# Altium project yaoyaobang.PrjPcb
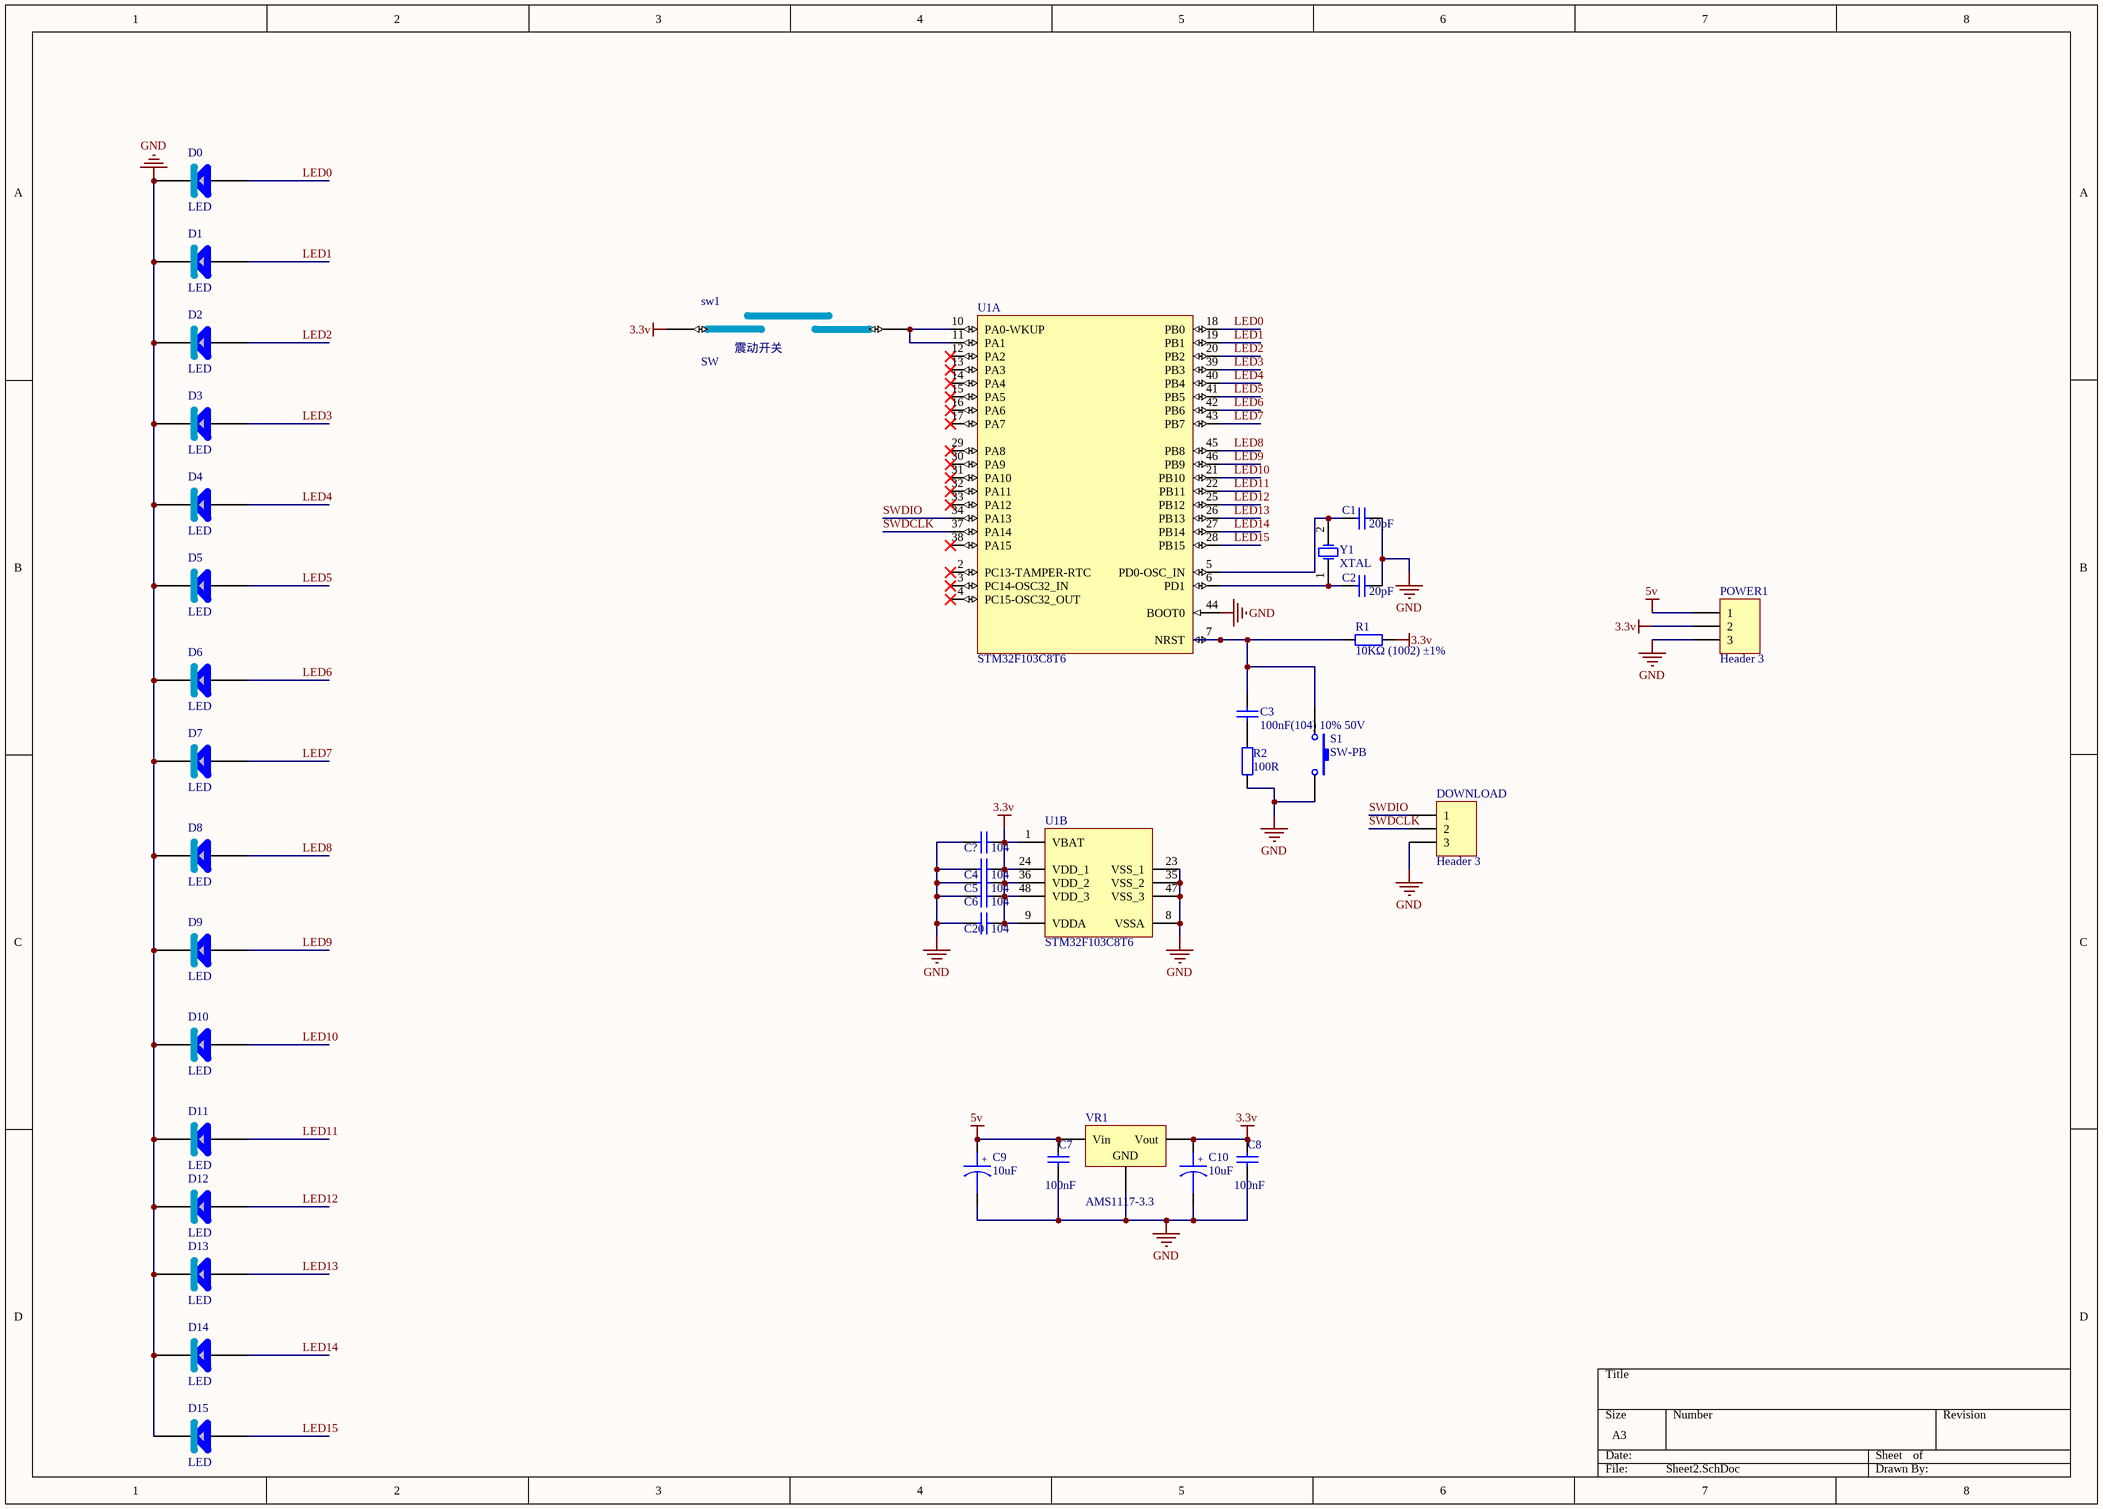
[diagram p0: Sheet2.SchDoc]
1 sheet, 37 parts. Net scope: global (net labels, ports and power ports of the same name join across sheets).
Board file: PCB1.PcbDoc

## Sheet Sheet2.SchDoc
size A3

### Parts
C1  20pF  [0805_C]
C2  20pF  [0805_C]
C3  100nF(104) 10% 50V  [0805_C]
C4  104  [0805_C]
C5  104  [0805_C]
C6  104  [0805_C]
C7  100nF  [0805_C]
C8  100nF  [0805_C]
C9  10uF  [0805_C]
C10  10uF  [0805_C]
C20  104  [0805_C]
C?  104  [0805_C]
D0  LED  [PCBComponent_1]
D1  LED  [PCBComponent_1]
D2  LED  [PCBComponent_1]
D3  LED  [PCBComponent_1]
D4  LED  [PCBComponent_1]
D5  LED  [PCBComponent_1]
D6  LED  [PCBComponent_1]
D7  LED  [PCBComponent_1]
D8  LED  [PCBComponent_1]
D9  LED  [PCBComponent_1]
D10  LED  [PCBComponent_1]
D11  LED  [PCBComponent_1]
D12  LED  [PCBComponent_1]
D13  LED  [PCBComponent_1]
D14  LED  [PCBComponent_1]
D15  LED  [PCBComponent_1]
DOWNLOAD  Header 3  [HDR1X3]
POWER1  Header 3  [HDR1X3]
R1  10KΩ (1002) ±1%  [0805_R]
R2  100R  [0805_R]
S1  SW-PB  [KEY_3*6]
sw1  SW  [PCBComponent_1 - duplicate]
U1  STM32F103C8T6  [LQFP-48_7x7x05P]  (parts A,B of 2)
VR1  AMS1117-3.3  [SOT-223]
Y1  XTAL  [BCY-W2/D3.1]

### Nets
3.3v: C4.2 C5.2 C6.2 C8.2 C10.1 C20.2 C?.2 POWER1.2 R1.1 sw1.3 U1.1(VBAT) U1.9(VDDA) U1.24(VDD_1) U1.36(VDD_2) U1.48(VDD_3) VR1.2(Vout)
5v: C7.2 C9.1 POWER1.1 VR1.3(Vin)
GND: C1.2 C2.2 C4.1 C5.1 C6.1 C7.1 C8.1 C9.2 C10.2 C20.1 C?.1 D0.1 D1.1 D2.1 D3.1 D4.1 D5.1 D6.1 D7.1 D8.1 D9.1 D10.1 D11.1 D12.1 D13.1 D14.1 D15.1 DOWNLOAD.3 POWER1.3 R2.1 S1.2 U1.8(VSSA) U1.23(VSS_1) U1.35(VSS_2) U1.44(BOOT0) U1.47(VSS_3) VR1.1(GND)
LED0: D0.0 U1.18(PB0)
LED1: D1.0 U1.19(PB1)
LED2: D2.0 U1.20(PB2)
LED3: D3.0 U1.39(PB3)
LED4: D4.0 U1.40(PB4)
LED5: D5.0 U1.41(PB5)
LED6: D6.0 U1.42(PB6)
LED7: D7.0 U1.43(PB7)
LED8: D8.0 U1.45(PB8)
LED9: D9.0 U1.46(PB9)
LED10: D10.0 U1.21(PB10)
LED11: D11.0 U1.22(PB11)
LED12: D12.0 U1.25(PB12)
LED13: D13.0 U1.26(PB13)
LED14: D14.0 U1.27(PB14)
LED15: D15.0 U1.28(PB15)
SWDCLK: DOWNLOAD.2 U1.37(PA14)
SWDIO: DOWNLOAD.1 U1.34(PA13)
NetC1_1: C1.1 U1.5(PD0-OSC_IN) Y1.2(OSC2)
NetC2_1: C2.1 U1.6(PD1) Y1.1(OSC1)
NetC3_1: C3.1 R1.2 S1.1 U1.7(NRST)
NetC3_2: C3.2 R2.2
Netsw1_2: sw1.2 U1.10(PA0-WKUP) U1.11(PA1)

Not connected (* = marked no-connect by the designer): U1 2(PC13-TAMPER-RTC)* 3(PC14-OSC32_IN)* 4(PC15-OSC32_OUT)* 12(PA2)* 13(PA3)* 14(PA4)* 15(PA5)* 16(PA6)* 17(PA7)* 29(PA8)* 30(PA9)* 31(PA10)* 32(PA11)* 33(PA12)* 38(PA15)*

### Notes on the sheet
- (in symbol SW) 震动开关
- (in symbol 电解电容) +

### Library data of the parts
C1 C2 = 0805 20pF (200) 5% 50V: 贴片电容; ComponentLink1Description: 供应商链接; ComponentLink1URL: http://www.szlcsc.com/product/details_2150.html; Package: 0805; Supplier: LC; SuppliersPartNumber: C1798
C3-C8 C20 C? = 0805 100nF(104) 10% 50V: 贴片电容; ComponentLink1Description: 供应商链接; ComponentLink1URL: http://www.szlcsc.com/product/details_50686.html; Package: 0805; Supplier: LC; SuppliersPartNumber: C49678
C9 C10 = 电解电容: Capacitor
DOWNLOAD POWER1 = Header 3: Header, 3-Pin; LatestRevisionDate: 17-Jul-2002; LatestRevisionNote: Re-released for DXP Platform.; Publisher: Altium Limited
R1 R2 = 0805 10KΩ (1002) 1%: 贴片电阻; ComponentLink1Description: 供应商链接; ComponentLink1URL: http://www.szlcsc.com/product/details_18102.html; Package: 0805; Supplier: LC; SuppliersPartNumber: C17414
S1 = SW-PB: Switch; pin to pad: 2>0; Published: 24-Mar-1999; LatestRevisionDate: 17-Jul-2002; LatestRevisionNote: Re-released for DXP Platform.; PackageReference: SPST-2; Publisher: Altium Limited; PackageDescription: Switch; 2 Leads
U1 = STM32F103C8T6: ARM; ComponentLink1Description: 供应商链接; ComponentLink1URL: http://www.szlcsc.com/product/details_9243.html; Package: LQFP-48_7x7x05P; Supplier: LC; SuppliersPartNumber: C8734
VR1 = SOT-223 AMS1117-3.3: 低压差线性稳压(LDO); ComponentLink1Description: 供应商链接; ComponentLink1URL: http://www.szlcsc.com/product/details_6652.html; Package: SOT-223; Supplier: LC; SuppliersPartNumber: C6186
Y1 = XTAL: Crystal Oscillator; Published: 8-Jun-2000; Revision: July-2002: Re-released for DXP Platform.; Publisher: Altium Limited